# Altium project Copy of MB1248.PrjPCB (part 1 of 3)
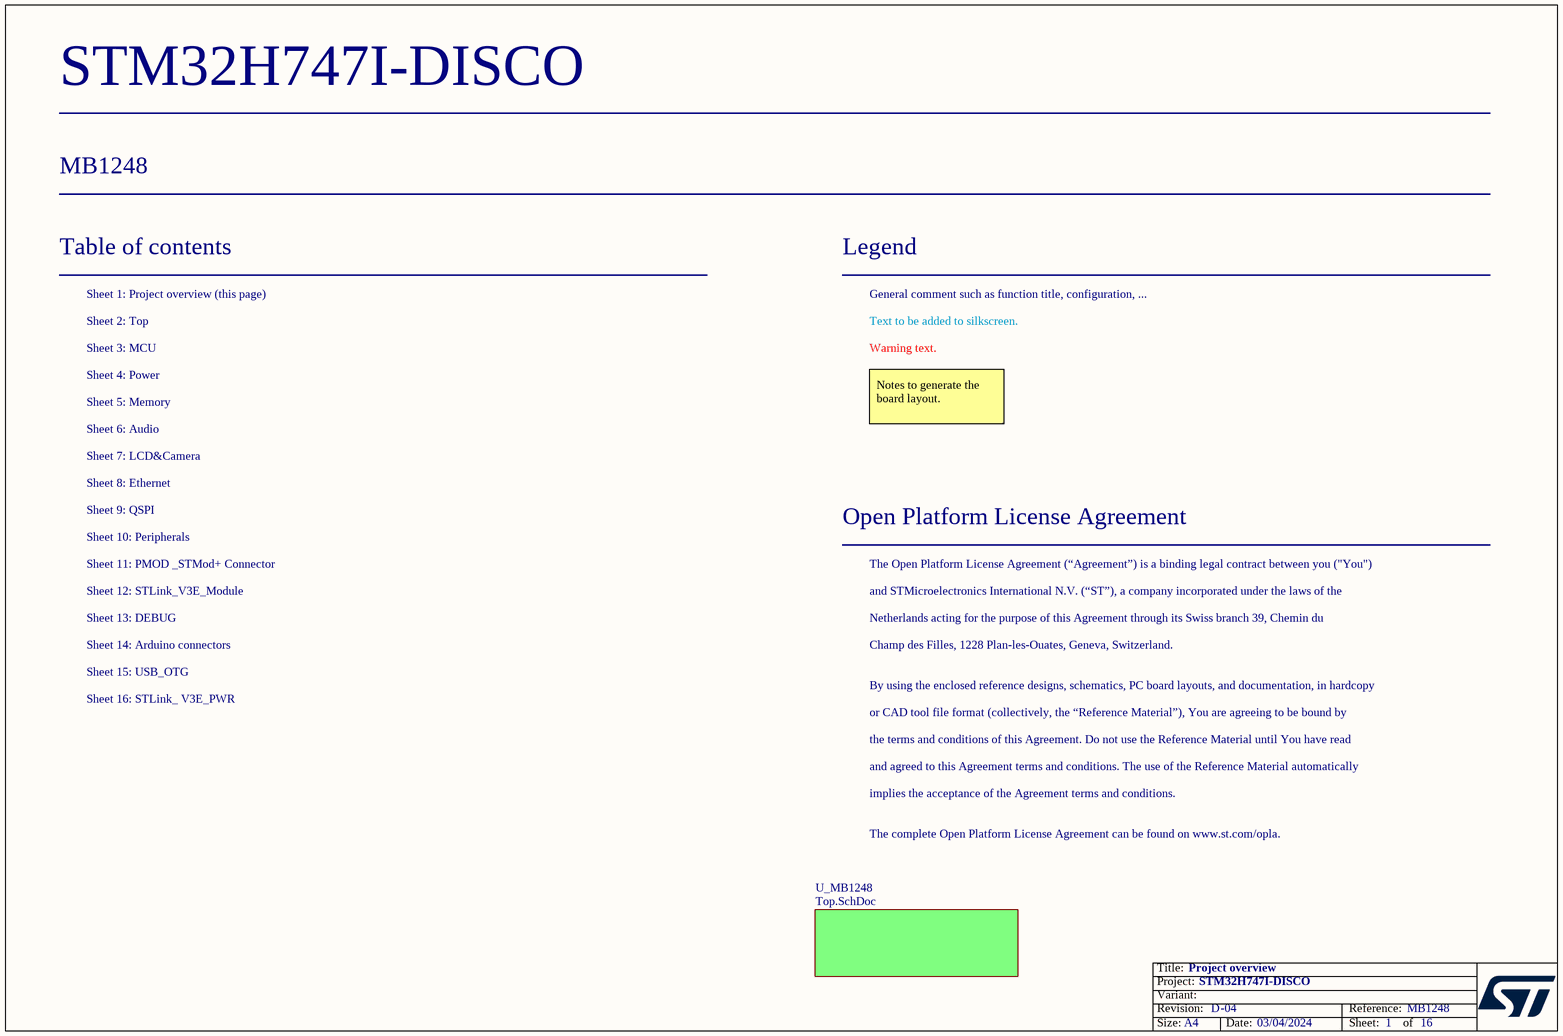
[diagram p0: Project_overview.SchDoc]
Board_Assembly_revision: 04; Board_Document_Date: 03/04/2024; Board_Name: STM32H747I-DISCO; Board_PCB_Revision: D; Board_Reference: MB1248
16 sheets, 533 parts. Net scope: flat (ports and power ports of the same name join across sheets).
Board file: PCB1.PcbDoc
Sheets:
  Project_overview.SchDoc
    U_MB1248 = Top.SchDoc
      U_MCU = MCU.SchDoc
      U_Memory = Memory.SchDoc
      U_QSPI = QSPI.SchDoc
      U_Audio = Audio.SchDoc
      U_Ethernet = Ethernet.SchDoc
      U_Peripherals = Peripherals.SchDoc
      U_Arduino Connectors = Arduino_Connectors.SchDoc
      U_Power = Power.SchDoc
      U_USB_OTG = USB_OTG .SchDoc
      U_LCD&Camera Connectors = LCD&Camera Connectors.SchDoc
      U_DEBUG = DEBUG.SchDoc
      U_STLink_V3E_Module = STLink_V3E_Module.SchDoc
      U_STLink_V3E_PWR = STLink_V3E_PWR.SchDoc
      U_PMOD_STMod+ connector = PMOD_STMod+ connector .SchDoc

## Sheet Project_overview.SchDoc: Project overview
size A4; Date: Not used; ApprovedBy: Not used; CheckedBy: Not used; Author: Not used; CompanyName: STMicroelectronics; DrawnBy: Not used; Engineer: Not used; Organization: Not used; Address1: Not used; Address2: Not used; Address3: Not used; Address4: Not used; DocumentNumber: MB1166; Revision: Not used; SheetNumber: 1; SheetTotal: 16; CurrentTime: Not used; CurrentDate: Not used; Time: Not used; DocumentFullPathAndName: Not used; DocumentName: Not used; ModifiedDate: Not used; ImagePath: Not used; ProjectName: Not used; Application_BuildNumber: Not used

### Sub-sheets
U_MB1248 = Top.SchDoc: no entries

### Notes on the sheet
- Table of contents
- Sheet 1: Project overview (this page)
- Legend
- General comment such as function title, configuration, ...
- Sheet 2: Top
- Sheet 3: MCU
- Sheet 4: Power
- Text to be added to silkscreen.
- Warning text.
- Sheet 5: Memory
- Sheet 6: Audio
- Notes to generate the board layout.
- Sheet 7: LCD&Camera
- Sheet 8: Ethernet
- Sheet 9: QSPI
- Sheet 10: Peripherals
- Sheet 11: PMOD _STMod+ Connector
- Open Platform License Agreement
- The Open Platform License Agreement (“Agreement”) is a binding legal contract between you ("You")
- Sheet 12: STLink_V3E_Module
- Sheet 13: DEBUG
- Sheet 14: Arduino connectors
- and STMicroelectronics International N.V. (“ST”), a company incorporated under the laws of the
- Netherlands acting for the purpose of this Agreement through its Swiss branch 39, Chemin du
- Champ des Filles, 1228 Plan-les-Ouates, Geneva, Switzerland.
- Sheet 15: USB_OTG
- Sheet 16: STLink_ V3E_PWR
- By using the enclosed reference designs, schematics, PC board layouts, and documentation, in hardcopy
- or CAD tool file format (collectively, the “Reference Material”), You are agreeing to be bound by
- the terms and conditions of this Agreement. Do not use the Reference Material until You have read
- and agreed to this Agreement terms and conditions. The use of the Reference Material automatically
- implies the acceptance of the Agreement terms and conditions.
- The complete Open Platform License Agreement can be found on www.st.com/opla.
- Title:
- Project:
- Size:
- Revision:
- Variant:
- A4
- -
- Date:
- Reference:
- Sheet:
- of

## Sheet Top.SchDoc: Top
size A3; Project: STM32H7-DK; Date: Not used; ApprovedBy: Not used; CheckedBy: Not used; Author: Not used; CompanyName: STMicroelectronics; DrawnBy: Not used; Engineer: Not used; Organization: Not used; Address1: Not used; Address2: Not used; Address3: Not used; Address4: Not used; DocumentNumber: Not used; Revision: Not used; SheetNumber: 2; SheetTotal: 16; CurrentTime: Not used; CurrentDate: Not used; Time: Not used; DocumentFullPathAndName: Not used; DocumentName: Not used; ModifiedDate: Not used; ImagePath: Not used; ProjectName: Not used; Application_BuildNumber: Not used
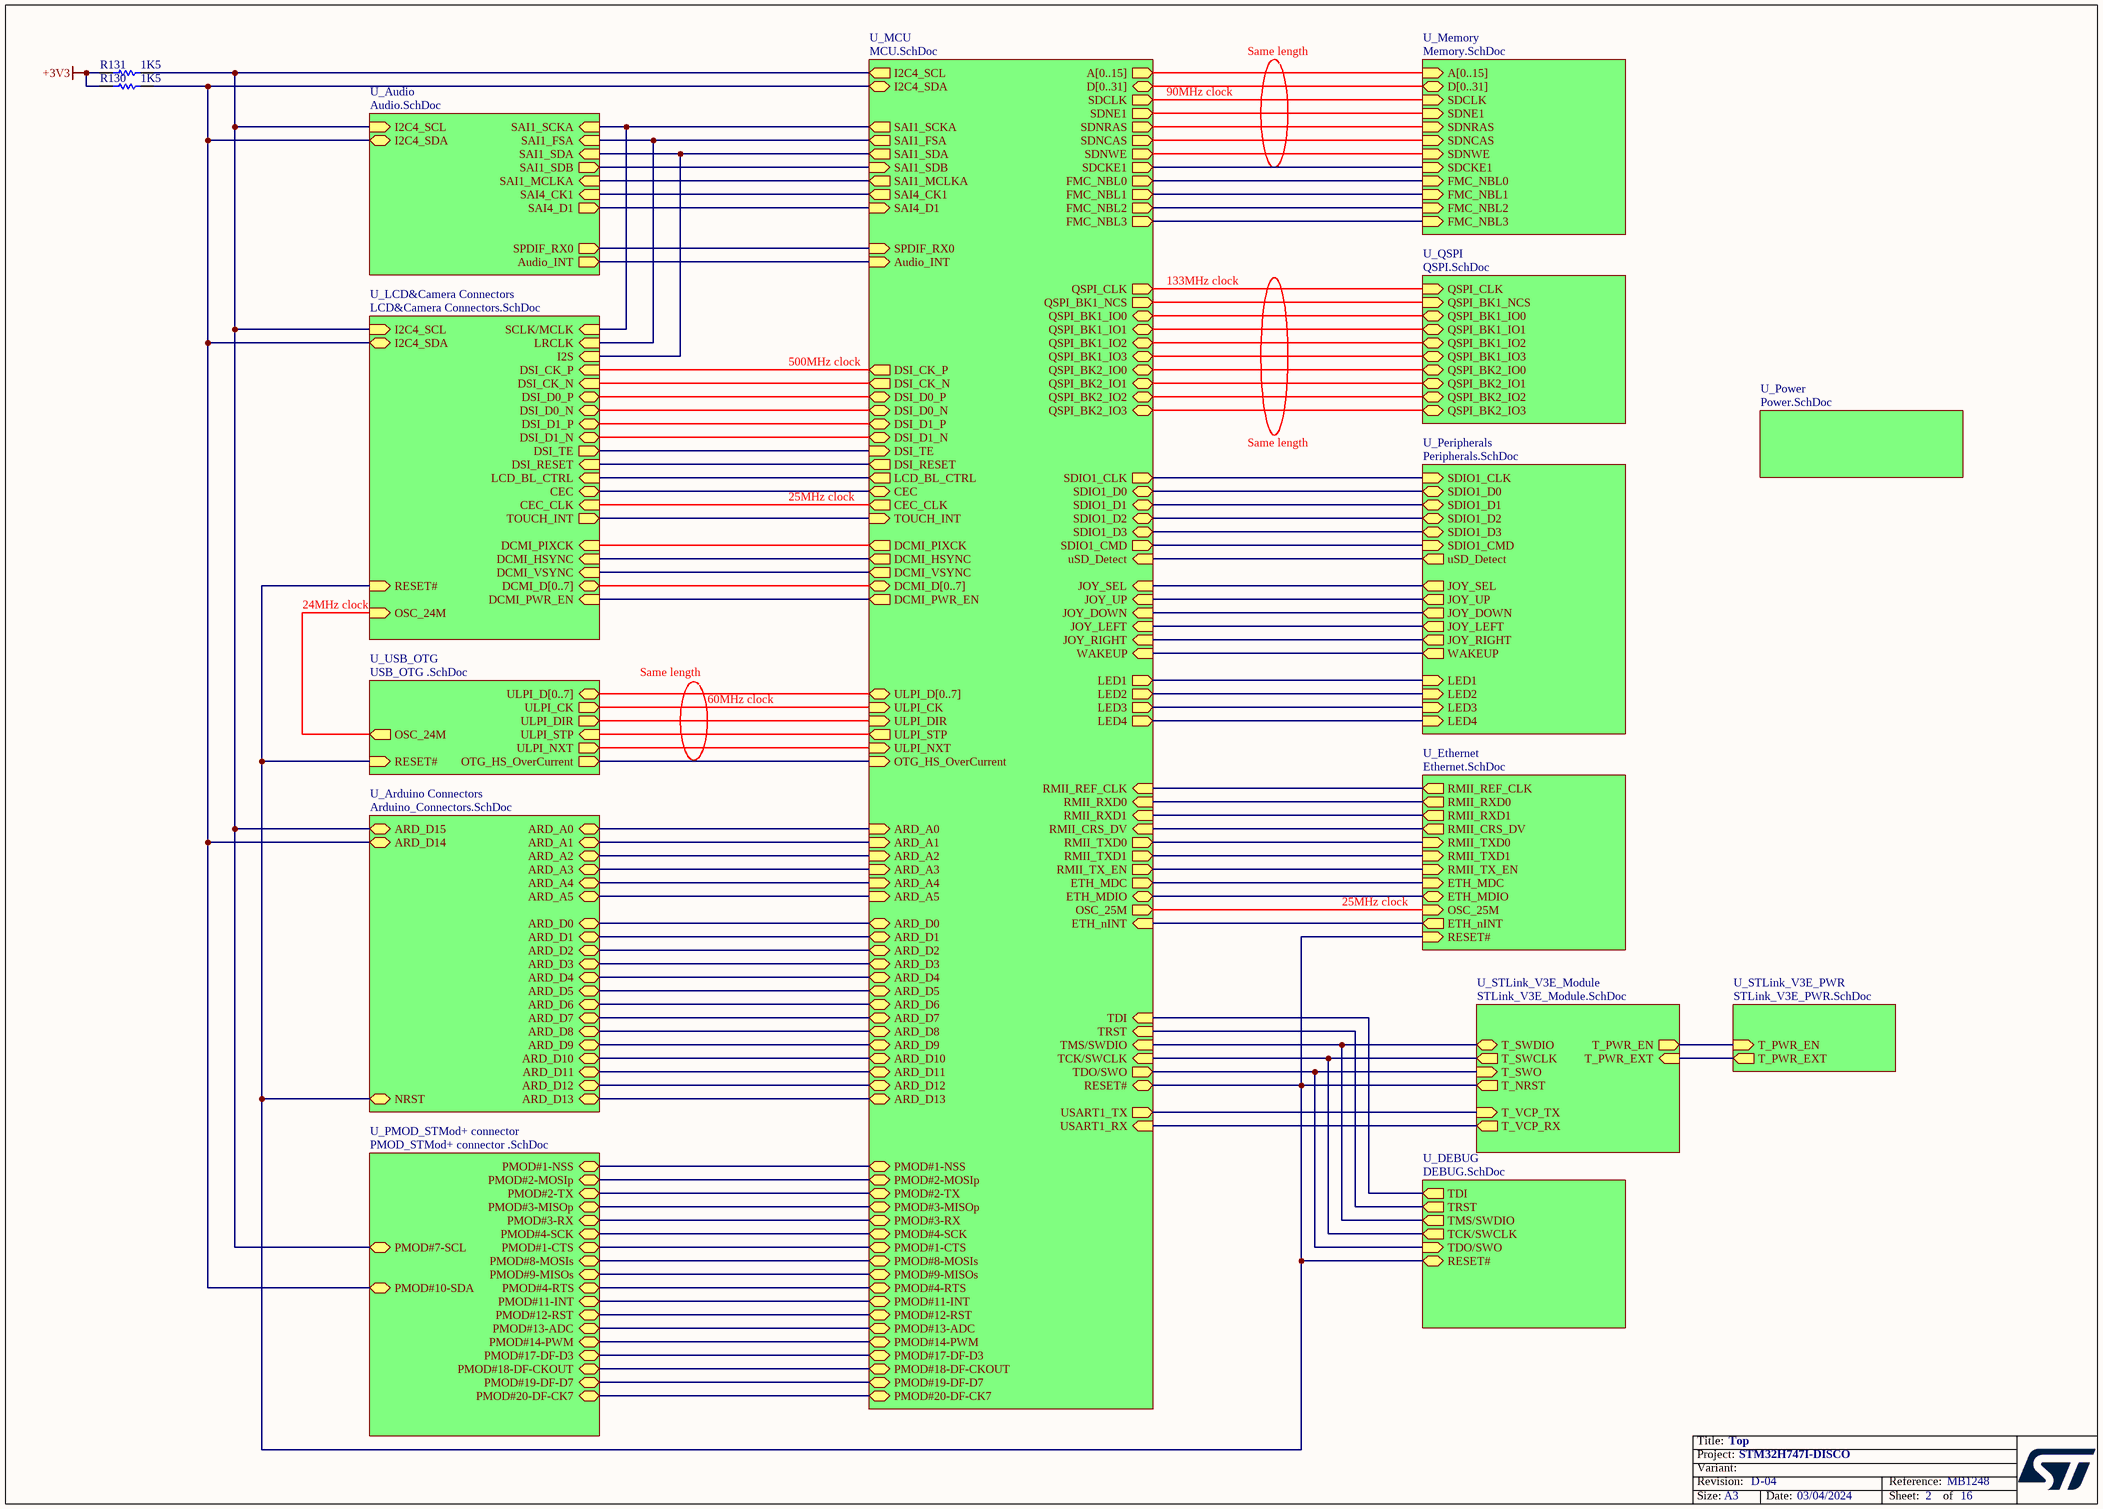
[diagram p1: Top.SchDoc]

### Parts
R130  1K5  [0603R]
R131  1K5  [0603R]

### Sub-sheets
U_Arduino Connectors = Arduino_Connectors.SchDoc: NRST (bidir), ARD_A0 (bidir), ARD_A1 (bidir), ARD_A2 (bidir), ARD_A3 (bidir), ARD_A4 (bidir), ARD_A5 (bidir), ARD_D5 (bidir), ARD_D4 (bidir), ARD_D3 (bidir), ARD_D2 (bidir), ARD_D1 (bidir), ARD_D0 (bidir), ARD_D13 (bidir), ARD_D12 (bidir), ARD_D11 (bidir), ARD_D10 (bidir), ARD_D9 (bidir), ARD_D8 (bidir), ARD_D6 (bidir), ARD_D7 (bidir), ARD_D15 (bidir), ARD_D14 (bidir)
U_Audio = Audio.SchDoc: SAI1_SCKA (in), SAI1_FSA (in), SAI1_SDA (in), SAI1_SDB (out), Audio_INT (out), I2C4_SDA (bidir), I2C4_SCL (in), SAI1_MCLKA (in), SPDIF_RX0 (out), SAI4_CK1 (in), SAI4_D1 (out)
U_DEBUG = DEBUG.SchDoc: TDI (out), RESET# (bidir), TRST (out), TMS/SWDIO (out), TCK/SWCLK (out), TDO/SWO (in)
U_Ethernet = Ethernet.SchDoc: RMII_TXD0 (in), RMII_TX_EN (in), RMII_RXD0 (out), RMII_REF_CLK (out), RMII_CRS_DV (out), ETH_MDC (in), ETH_MDIO (bidir), RMII_TXD1 (in), RMII_RXD1 (out), RESET# (in), OSC_25M (in), ETH_nINT (out)
U_LCD&Camera Connectors = LCD&Camera Connectors.SchDoc: TOUCH_INT (out), DSI_CK_P (in), DSI_CK_N (in), DSI_D0_P (bidir), DSI_D0_N (bidir), DSI_D1_P (bidir), DSI_D1_N (bidir), LCD_BL_CTRL (in), DSI_TE (out), DSI_RESET (in), SCLK/MCLK (in), LRCLK (in), I2S (in), CEC (bidir), CEC_CLK (in), DCMI_D[0..7] (bidir), DCMI_PWR_EN (in), DCMI_VSYNC (in), DCMI_HSYNC (in), DCMI_PIXCK (in), RESET# (in), I2C4_SCL (in), I2C4_SDA (bidir), OSC_24M (in)
U_MCU = MCU.SchDoc: TMS/SWDIO (in), TCK/SWCLK (in), TDI (in), ULPI_STP (out), ETH_MDC (out), RMII_RXD0 (in), RMII_RXD1 (in), SDIO1_D0 (bidir), SDIO1_CLK (out), SDIO1_CMD (out), uSD_Detect (in), FMC_NBL3 (out), FMC_NBL2 (out), FMC_NBL0 (out), FMC_NBL1 (out), SAI1_SDA (out), SAI1_SDB (in), SAI1_SCKA (out), SAI1_FSA (out), SAI1_MCLKA (out), SDNRAS (out), SDCLK (out), RMII_TX_EN (out), RMII_TXD1 (out), SDNCAS (out), SDCKE1 (out), SDNE1 (out), ULPI_NXT (in), SDNWE (out), D[0..31] (bidir), A[0..15] (out), ULPI_D[0..7] (bidir), QSPI_BK1_IO3 (bidir), QSPI_BK1_IO2 (bidir), QSPI_BK1_IO1 (bidir), DSI_TE (in), DSI_CK_P (out), DSI_CK_N (out), DSI_D0_P (bidir), DSI_D0_N (bidir), DSI_D1_P (bidir), DSI_D1_N (bidir), ARD_A1 (in), LED1 (out), LED2 (out), LED3 (out), LED4 (out), RMII_REF_CLK (in), ETH_MDIO (bidir), ULPI_CK (in), RMII_CRS_DV (in), CEC_CLK (out), TDO/SWO (out), TRST (in), QSPI_BK1_NCS (out), RMII_TXD0 (out), QSPI_CLK (out), SDIO1_D1 (bidir), SDIO1_D2 (bidir), SDIO1_D3 (bidir), QSPI_BK2_IO2 (bidir), QSPI_BK2_IO3 (bidir), QSPI_BK2_IO0 (bidir), QSPI_BK2_IO1 (bidir), RESET# (bidir), CEC (bidir), DCMI_PWR_EN (out), DCMI_VSYNC (out), DCMI_HSYNC (out), DCMI_PIXCK (out), ARD_A0 (in), ARD_A2 (in), ARD_A3 (in), ARD_A5 (in), ARD_A4 (in), ARD_D10 (bidir), ARD_D11 (bidir), ARD_D12 (bidir), ARD_D13 (bidir), I2C4_SCL (out), I2C4_SDA (bidir), ARD_D1 (bidir), ARD_D2 (bidir), ARD_D3 (bidir), ARD_D4 (bidir), ARD_D5 (bidir), ARD_D6 (bidir), ARD_D7 (bidir), ARD_D8 (bidir), ARD_D9 (bidir), ARD_D0 (bidir), Audio_INT (in), LCD_BL_CTRL (out), DSI_RESET (out), JOY_SEL (in), JOY_DOWN (in), JOY_LEFT (in), JOY_RIGHT (in), JOY_UP (in), TOUCH_INT (in), OTG_HS_OverCurrent (in), QSPI_BK1_IO0 (bidir), SPDIF_RX0 (in), ULPI_DIR (in), OSC_25M (out), DCMI_D[0..7] (bidir), PMOD#3-MISOp (bidir), PMOD#2-TX (bidir), PMOD#2-MOSIp (bidir), PMOD#3-RX (bidir), PMOD#8-MOSIs (bidir), PMOD#9-MISOs (bidir), PMOD#11-INT (bidir), PMOD#12-RST (bidir), PMOD#13-ADC (bidir), PMOD#14-PWM (bidir), PMOD#17-DF-D3 (bidir), PMOD#19-DF-D7 (bidir), PMOD#20-DF-CK7 (bidir), WAKEUP (in), PMOD#18-DF-CKOUT (bidir), SAI4_CK1 (out), SAI4_D1 (in), PMOD#1-NSS (bidir), PMOD#4-RTS (bidir), USART1_TX (out), PMOD#1-CTS (bidir), PMOD#4-SCK (bidir), USART1_RX (in), ETH_nINT (in)
U_Memory = Memory.SchDoc: FMC_NBL0 (in), FMC_NBL1 (in), D[0..31] (bidir), A[0..15] (in), SDNCAS (in), SDNWE (in), SDNRAS (in), SDNE1 (in), SDCKE1 (in), SDCLK (in), FMC_NBL3 (in), FMC_NBL2 (in)
U_Peripherals = Peripherals.SchDoc: JOY_SEL (out), JOY_DOWN (out), JOY_LEFT (out), JOY_RIGHT (out), JOY_UP (out), LED4 (in), LED3 (in), LED1 (in), LED2 (in), uSD_Detect (out), WAKEUP (out), SDIO1_CLK (in), SDIO1_CMD (in), SDIO1_D0 (bidir), SDIO1_D1 (bidir), SDIO1_D2 (bidir), SDIO1_D3 (bidir)
U_PMOD_STMod+ connector = PMOD_STMod+ connector .SchDoc: PMOD#11-INT (bidir), PMOD#12-RST (bidir), PMOD#1-NSS (bidir), PMOD#3-MISOp (bidir), PMOD#2-TX (bidir), PMOD#2-MOSIp (bidir), PMOD#3-RX (bidir), PMOD#7-SCL (bidir), PMOD#4-SCK (bidir), PMOD#8-MOSIs (bidir), PMOD#9-MISOs (bidir), PMOD#10-SDA (bidir), PMOD#13-ADC (bidir), PMOD#14-PWM (bidir), PMOD#17-DF-D3 (bidir), PMOD#18-DF-CKOUT (bidir), PMOD#19-DF-D7 (bidir), PMOD#20-DF-CK7 (bidir), PMOD#1-CTS (bidir), PMOD#4-RTS (bidir)
U_Power = Power.SchDoc: no entries
U_QSPI = QSPI.SchDoc: QSPI_BK1_IO3 (bidir), QSPI_BK1_IO1 (bidir), QSPI_BK1_NCS (in), QSPI_BK1_IO0 (bidir), QSPI_BK1_IO2 (bidir), QSPI_CLK (in), QSPI_BK2_IO0 (bidir), QSPI_BK2_IO1 (bidir), QSPI_BK2_IO2 (bidir), QSPI_BK2_IO3 (bidir)
U_STLink_V3E_Module = STLink_V3E_Module.SchDoc: T_SWCLK (out), T_SWO (in), T_NRST (out), T_SWDIO (bidir), T_PWR_EXT (in), T_PWR_EN (out), T_VCP_RX (out), T_VCP_TX (in)
U_STLink_V3E_PWR = STLink_V3E_PWR.SchDoc: T_PWR_EXT (out), T_PWR_EN (in)
U_USB_OTG = USB_OTG .SchDoc: ULPI_D[0..7] (bidir), ULPI_CK (out), ULPI_DIR (out), ULPI_NXT (out), ULPI_STP (in), RESET# (in), OTG_HS_OverCurrent (out), OSC_24M (out)

### Nets
+3V3: R130.1 R131.1
NetR130_2: R130.2 ; sheet U_MCU/I2C4_SDA, sheet U_Audio/I2C4_SDA, sheet U_Arduino Connectors/ARD_D14, sheet U_LCD&Camera Connectors/I2C4_SDA, sheet U_PMOD_STMod+ connector/PMOD#10-SDA
NetR131_2: R131.2 ; sheet U_MCU/I2C4_SCL, sheet U_Audio/I2C4_SCL, sheet U_Arduino Connectors/ARD_D15, sheet U_LCD&Camera Connectors/I2C4_SCL, sheet U_PMOD_STMod+ connector/PMOD#7-SCL
(unnamed): sheet U_MCU/TMS/SWDIO, sheet U_DEBUG/TMS/SWDIO, sheet U_STLink_V3E_Module/T_SWDIO
(unnamed): sheet U_MCU/TCK/SWCLK, sheet U_DEBUG/TCK/SWCLK, sheet U_STLink_V3E_Module/T_SWCLK
(unnamed): sheet U_MCU/TDI, sheet U_DEBUG/TDI
(unnamed): sheet U_MCU/ULPI_STP, sheet U_USB_OTG/ULPI_STP
(unnamed): sheet U_MCU/ETH_MDC, sheet U_Ethernet/ETH_MDC
(unnamed): sheet U_MCU/RMII_RXD0, sheet U_Ethernet/RMII_RXD0
(unnamed): sheet U_MCU/RMII_RXD1, sheet U_Ethernet/RMII_RXD1
(unnamed): sheet U_MCU/SDIO1_D0, sheet U_Peripherals/SDIO1_D0
(unnamed): sheet U_MCU/SDIO1_CLK, sheet U_Peripherals/SDIO1_CLK
(unnamed): sheet U_MCU/SDIO1_CMD, sheet U_Peripherals/SDIO1_CMD
(unnamed): sheet U_MCU/uSD_Detect, sheet U_Peripherals/uSD_Detect
(unnamed): sheet U_MCU/FMC_NBL3, sheet U_Memory/FMC_NBL3
(unnamed): sheet U_MCU/FMC_NBL2, sheet U_Memory/FMC_NBL2
(unnamed): sheet U_MCU/FMC_NBL0, sheet U_Memory/FMC_NBL0
(unnamed): sheet U_MCU/FMC_NBL1, sheet U_Memory/FMC_NBL1
(unnamed): sheet U_MCU/SAI1_SDA, sheet U_Audio/SAI1_SDA, sheet U_LCD&Camera Connectors/I2S
(unnamed): sheet U_MCU/SAI1_SDB, sheet U_Audio/SAI1_SDB
(unnamed): sheet U_MCU/SAI1_SCKA, sheet U_Audio/SAI1_SCKA, sheet U_LCD&Camera Connectors/SCLK/MCLK
(unnamed): sheet U_MCU/SAI1_FSA, sheet U_Audio/SAI1_FSA, sheet U_LCD&Camera Connectors/LRCLK
(unnamed): sheet U_MCU/SAI1_MCLKA, sheet U_Audio/SAI1_MCLKA
(unnamed): sheet U_MCU/SDNRAS, sheet U_Memory/SDNRAS
(unnamed): sheet U_MCU/SDCLK, sheet U_Memory/SDCLK
(unnamed): sheet U_MCU/RMII_TX_EN, sheet U_Ethernet/RMII_TX_EN
(unnamed): sheet U_MCU/RMII_TXD1, sheet U_Ethernet/RMII_TXD1
(unnamed): sheet U_MCU/SDNCAS, sheet U_Memory/SDNCAS
(unnamed): sheet U_MCU/SDCKE1, sheet U_Memory/SDCKE1
(unnamed): sheet U_MCU/SDNE1, sheet U_Memory/SDNE1
(unnamed): sheet U_MCU/ULPI_NXT, sheet U_USB_OTG/ULPI_NXT
(unnamed): sheet U_MCU/SDNWE, sheet U_Memory/SDNWE
(unnamed): sheet U_MCU/QSPI_BK1_IO3, sheet U_QSPI/QSPI_BK1_IO3
(unnamed): sheet U_MCU/QSPI_BK1_IO2, sheet U_QSPI/QSPI_BK1_IO2
(unnamed): sheet U_MCU/QSPI_BK1_IO1, sheet U_QSPI/QSPI_BK1_IO1
(unnamed): sheet U_MCU/DSI_TE, sheet U_LCD&Camera Connectors/DSI_TE
(unnamed): sheet U_MCU/DSI_CK_P, sheet U_LCD&Camera Connectors/DSI_CK_P
(unnamed): sheet U_MCU/DSI_CK_N, sheet U_LCD&Camera Connectors/DSI_CK_N
(unnamed): sheet U_MCU/DSI_D0_P, sheet U_LCD&Camera Connectors/DSI_D0_P
(unnamed): sheet U_MCU/DSI_D0_N, sheet U_LCD&Camera Connectors/DSI_D0_N
(unnamed): sheet U_MCU/DSI_D1_P, sheet U_LCD&Camera Connectors/DSI_D1_P
(unnamed): sheet U_MCU/DSI_D1_N, sheet U_LCD&Camera Connectors/DSI_D1_N
(unnamed): sheet U_MCU/ARD_A1, sheet U_Arduino Connectors/ARD_A1
(unnamed): sheet U_MCU/LED1, sheet U_Peripherals/LED1
(unnamed): sheet U_MCU/LED2, sheet U_Peripherals/LED2
(unnamed): sheet U_MCU/LED3, sheet U_Peripherals/LED3
(unnamed): sheet U_MCU/LED4, sheet U_Peripherals/LED4
(unnamed): sheet U_MCU/RMII_REF_CLK, sheet U_Ethernet/RMII_REF_CLK
(unnamed): sheet U_MCU/ETH_MDIO, sheet U_Ethernet/ETH_MDIO
(unnamed): sheet U_MCU/ULPI_CK, sheet U_USB_OTG/ULPI_CK
(unnamed): sheet U_MCU/RMII_CRS_DV, sheet U_Ethernet/RMII_CRS_DV
(unnamed): sheet U_MCU/CEC_CLK, sheet U_LCD&Camera Connectors/CEC_CLK
(unnamed): sheet U_MCU/TDO/SWO, sheet U_DEBUG/TDO/SWO, sheet U_STLink_V3E_Module/T_SWO
(unnamed): sheet U_MCU/TRST, sheet U_DEBUG/TRST
(unnamed): sheet U_MCU/QSPI_BK1_NCS, sheet U_QSPI/QSPI_BK1_NCS
(unnamed): sheet U_MCU/RMII_TXD0, sheet U_Ethernet/RMII_TXD0
(unnamed): sheet U_MCU/QSPI_CLK, sheet U_QSPI/QSPI_CLK
(unnamed): sheet U_MCU/SDIO1_D1, sheet U_Peripherals/SDIO1_D1
(unnamed): sheet U_MCU/SDIO1_D2, sheet U_Peripherals/SDIO1_D2
(unnamed): sheet U_MCU/SDIO1_D3, sheet U_Peripherals/SDIO1_D3
(unnamed): sheet U_MCU/QSPI_BK2_IO2, sheet U_QSPI/QSPI_BK2_IO2
(unnamed): sheet U_MCU/QSPI_BK2_IO3, sheet U_QSPI/QSPI_BK2_IO3
(unnamed): sheet U_MCU/QSPI_BK2_IO0, sheet U_QSPI/QSPI_BK2_IO0
(unnamed): sheet U_MCU/QSPI_BK2_IO1, sheet U_QSPI/QSPI_BK2_IO1
(unnamed): sheet U_MCU/RESET#, sheet U_Ethernet/RESET#, sheet U_Arduino Connectors/NRST, sheet U_USB_OTG/RESET#, sheet U_LCD&Camera Connectors/RESET#, sheet U_DEBUG/RESET#, sheet U_STLink_V3E_Module/T_NRST
(unnamed): sheet U_MCU/CEC, sheet U_LCD&Camera Connectors/CEC
(unnamed): sheet U_MCU/DCMI_PWR_EN, sheet U_LCD&Camera Connectors/DCMI_PWR_EN
(unnamed): sheet U_MCU/DCMI_VSYNC, sheet U_LCD&Camera Connectors/DCMI_VSYNC
(unnamed): sheet U_MCU/DCMI_HSYNC, sheet U_LCD&Camera Connectors/DCMI_HSYNC
(unnamed): sheet U_MCU/DCMI_PIXCK, sheet U_LCD&Camera Connectors/DCMI_PIXCK
(unnamed): sheet U_MCU/ARD_A0, sheet U_Arduino Connectors/ARD_A0
(unnamed): sheet U_MCU/ARD_A2, sheet U_Arduino Connectors/ARD_A2
(unnamed): sheet U_MCU/ARD_A3, sheet U_Arduino Connectors/ARD_A3
(unnamed): sheet U_MCU/ARD_A5, sheet U_Arduino Connectors/ARD_A5
(unnamed): sheet U_MCU/ARD_A4, sheet U_Arduino Connectors/ARD_A4
(unnamed): sheet U_MCU/ARD_D10, sheet U_Arduino Connectors/ARD_D10
(unnamed): sheet U_MCU/ARD_D11, sheet U_Arduino Connectors/ARD_D11
(unnamed): sheet U_MCU/ARD_D12, sheet U_Arduino Connectors/ARD_D12
(unnamed): sheet U_MCU/ARD_D13, sheet U_Arduino Connectors/ARD_D13
(unnamed): sheet U_MCU/ARD_D1, sheet U_Arduino Connectors/ARD_D1
(unnamed): sheet U_MCU/ARD_D2, sheet U_Arduino Connectors/ARD_D2
(unnamed): sheet U_MCU/ARD_D3, sheet U_Arduino Connectors/ARD_D3
(unnamed): sheet U_MCU/ARD_D4, sheet U_Arduino Connectors/ARD_D4
(unnamed): sheet U_MCU/ARD_D5, sheet U_Arduino Connectors/ARD_D5
(unnamed): sheet U_MCU/ARD_D6, sheet U_Arduino Connectors/ARD_D6
(unnamed): sheet U_MCU/ARD_D7, sheet U_Arduino Connectors/ARD_D7
(unnamed): sheet U_MCU/ARD_D8, sheet U_Arduino Connectors/ARD_D8
(unnamed): sheet U_MCU/ARD_D9, sheet U_Arduino Connectors/ARD_D9
(unnamed): sheet U_MCU/ARD_D0, sheet U_Arduino Connectors/ARD_D0
(unnamed): sheet U_MCU/Audio_INT, sheet U_Audio/Audio_INT
(unnamed): sheet U_MCU/LCD_BL_CTRL, sheet U_LCD&Camera Connectors/LCD_BL_CTRL
(unnamed): sheet U_MCU/DSI_RESET, sheet U_LCD&Camera Connectors/DSI_RESET
(unnamed): sheet U_MCU/JOY_SEL, sheet U_Peripherals/JOY_SEL
(unnamed): sheet U_MCU/JOY_DOWN, sheet U_Peripherals/JOY_DOWN
(unnamed): sheet U_MCU/JOY_LEFT, sheet U_Peripherals/JOY_LEFT
(unnamed): sheet U_MCU/JOY_RIGHT, sheet U_Peripherals/JOY_RIGHT
(unnamed): sheet U_MCU/JOY_UP, sheet U_Peripherals/JOY_UP
(unnamed): sheet U_MCU/TOUCH_INT, sheet U_LCD&Camera Connectors/TOUCH_INT
(unnamed): sheet U_MCU/OTG_HS_OverCurrent, sheet U_USB_OTG/OTG_HS_OverCurrent
(unnamed): sheet U_MCU/QSPI_BK1_IO0, sheet U_QSPI/QSPI_BK1_IO0
(unnamed): sheet U_MCU/SPDIF_RX0, sheet U_Audio/SPDIF_RX0
(unnamed): sheet U_MCU/ULPI_DIR, sheet U_USB_OTG/ULPI_DIR
(unnamed): sheet U_MCU/OSC_25M, sheet U_Ethernet/OSC_25M
(unnamed): sheet U_MCU/PMOD#3-MISOp, sheet U_PMOD_STMod+ connector/PMOD#3-MISOp
(unnamed): sheet U_MCU/PMOD#2-TX, sheet U_PMOD_STMod+ connector/PMOD#2-TX
(unnamed): sheet U_MCU/PMOD#2-MOSIp, sheet U_PMOD_STMod+ connector/PMOD#2-MOSIp
(unnamed): sheet U_MCU/PMOD#3-RX, sheet U_PMOD_STMod+ connector/PMOD#3-RX
(unnamed): sheet U_MCU/PMOD#8-MOSIs, sheet U_PMOD_STMod+ connector/PMOD#8-MOSIs
(unnamed): sheet U_MCU/PMOD#9-MISOs, sheet U_PMOD_STMod+ connector/PMOD#9-MISOs
(unnamed): sheet U_MCU/PMOD#11-INT, sheet U_PMOD_STMod+ connector/PMOD#11-INT
(unnamed): sheet U_MCU/PMOD#12-RST, sheet U_PMOD_STMod+ connector/PMOD#12-RST
(unnamed): sheet U_MCU/PMOD#13-ADC, sheet U_PMOD_STMod+ connector/PMOD#13-ADC
(unnamed): sheet U_MCU/PMOD#14-PWM, sheet U_PMOD_STMod+ connector/PMOD#14-PWM
(unnamed): sheet U_MCU/PMOD#17-DF-D3, sheet U_PMOD_STMod+ connector/PMOD#17-DF-D3
(unnamed): sheet U_MCU/PMOD#19-DF-D7, sheet U_PMOD_STMod+ connector/PMOD#19-DF-D7
(unnamed): sheet U_MCU/PMOD#20-DF-CK7, sheet U_PMOD_STMod+ connector/PMOD#20-DF-CK7
(unnamed): sheet U_MCU/WAKEUP, sheet U_Peripherals/WAKEUP
(unnamed): sheet U_MCU/PMOD#18-DF-CKOUT, sheet U_PMOD_STMod+ connector/PMOD#18-DF-CKOUT
(unnamed): sheet U_MCU/SAI4_CK1, sheet U_Audio/SAI4_CK1
(unnamed): sheet U_MCU/SAI4_D1, sheet U_Audio/SAI4_D1
(unnamed): sheet U_MCU/PMOD#1-NSS, sheet U_PMOD_STMod+ connector/PMOD#1-NSS
(unnamed): sheet U_MCU/PMOD#4-RTS, sheet U_PMOD_STMod+ connector/PMOD#4-RTS
(unnamed): sheet U_MCU/USART1_TX, sheet U_STLink_V3E_Module/T_VCP_TX
(unnamed): sheet U_MCU/PMOD#1-CTS, sheet U_PMOD_STMod+ connector/PMOD#1-CTS
(unnamed): sheet U_MCU/PMOD#4-SCK, sheet U_PMOD_STMod+ connector/PMOD#4-SCK
(unnamed): sheet U_MCU/USART1_RX, sheet U_STLink_V3E_Module/T_VCP_RX
(unnamed): sheet U_MCU/ETH_nINT, sheet U_Ethernet/ETH_nINT
(unnamed): sheet U_USB_OTG/OSC_24M, sheet U_LCD&Camera Connectors/OSC_24M
(unnamed): sheet U_STLink_V3E_Module/T_PWR_EXT, sheet U_STLink_V3E_PWR/T_PWR_EXT
(unnamed): sheet U_STLink_V3E_Module/T_PWR_EN, sheet U_STLink_V3E_PWR/T_PWR_EN

### Buses and harness runs
bus sheet U_LCD&Camera Connectors/DCMI_D[0..7] = sheet U_MCU/DCMI_D[0..7]
bus sheet U_MCU/A[0..15] = sheet U_Memory/A[0..15]
bus sheet U_MCU/D[0..31] = sheet U_Memory/D[0..31]
bus sheet U_MCU/ULPI_D[0..7] = sheet U_USB_OTG/ULPI_D[0..7]

### Notes on the sheet
- 90MHz clock
- Same length
- 133MHz clock
- 500MHz clock
- 25MHz clock
- 24MHz clock
- 60MHz clock
- Title:
- Project:
- Size:
- Revision:
- Variant:
- A3
- -
- Date:
- Reference:
- Sheet:
- of

### Library data of the parts
R130 R131 = Res1: Resistor; Value: 1K; Published: 8-Jun-2000; Revision: July-2002: Re-released for DXP Platform.; Publisher: Altium Limited

## Sheet MCU.SchDoc: MCU
size A3; Project: STM32H7-DK; Date: Not used; ApprovedBy: Not used; CheckedBy: Not used; Author: Not used; CompanyName: STMicroelectronics; DrawnBy: Not used; Engineer: Not used; Organization: Not used; Address1: Not used; Address2: Not used; Address3: Not used; Address4: Not used; DocumentNumber: Not used; Revision: Not used; SheetNumber: 3; SheetTotal: 16; CurrentTime: Not used; CurrentDate: Not used; Time: Not used; DocumentFullPathAndName: Not used; DocumentName: Not used; ModifiedDate: Not used; ImagePath: Not used; ProjectName: Not used; Application_BuildNumber: Not used
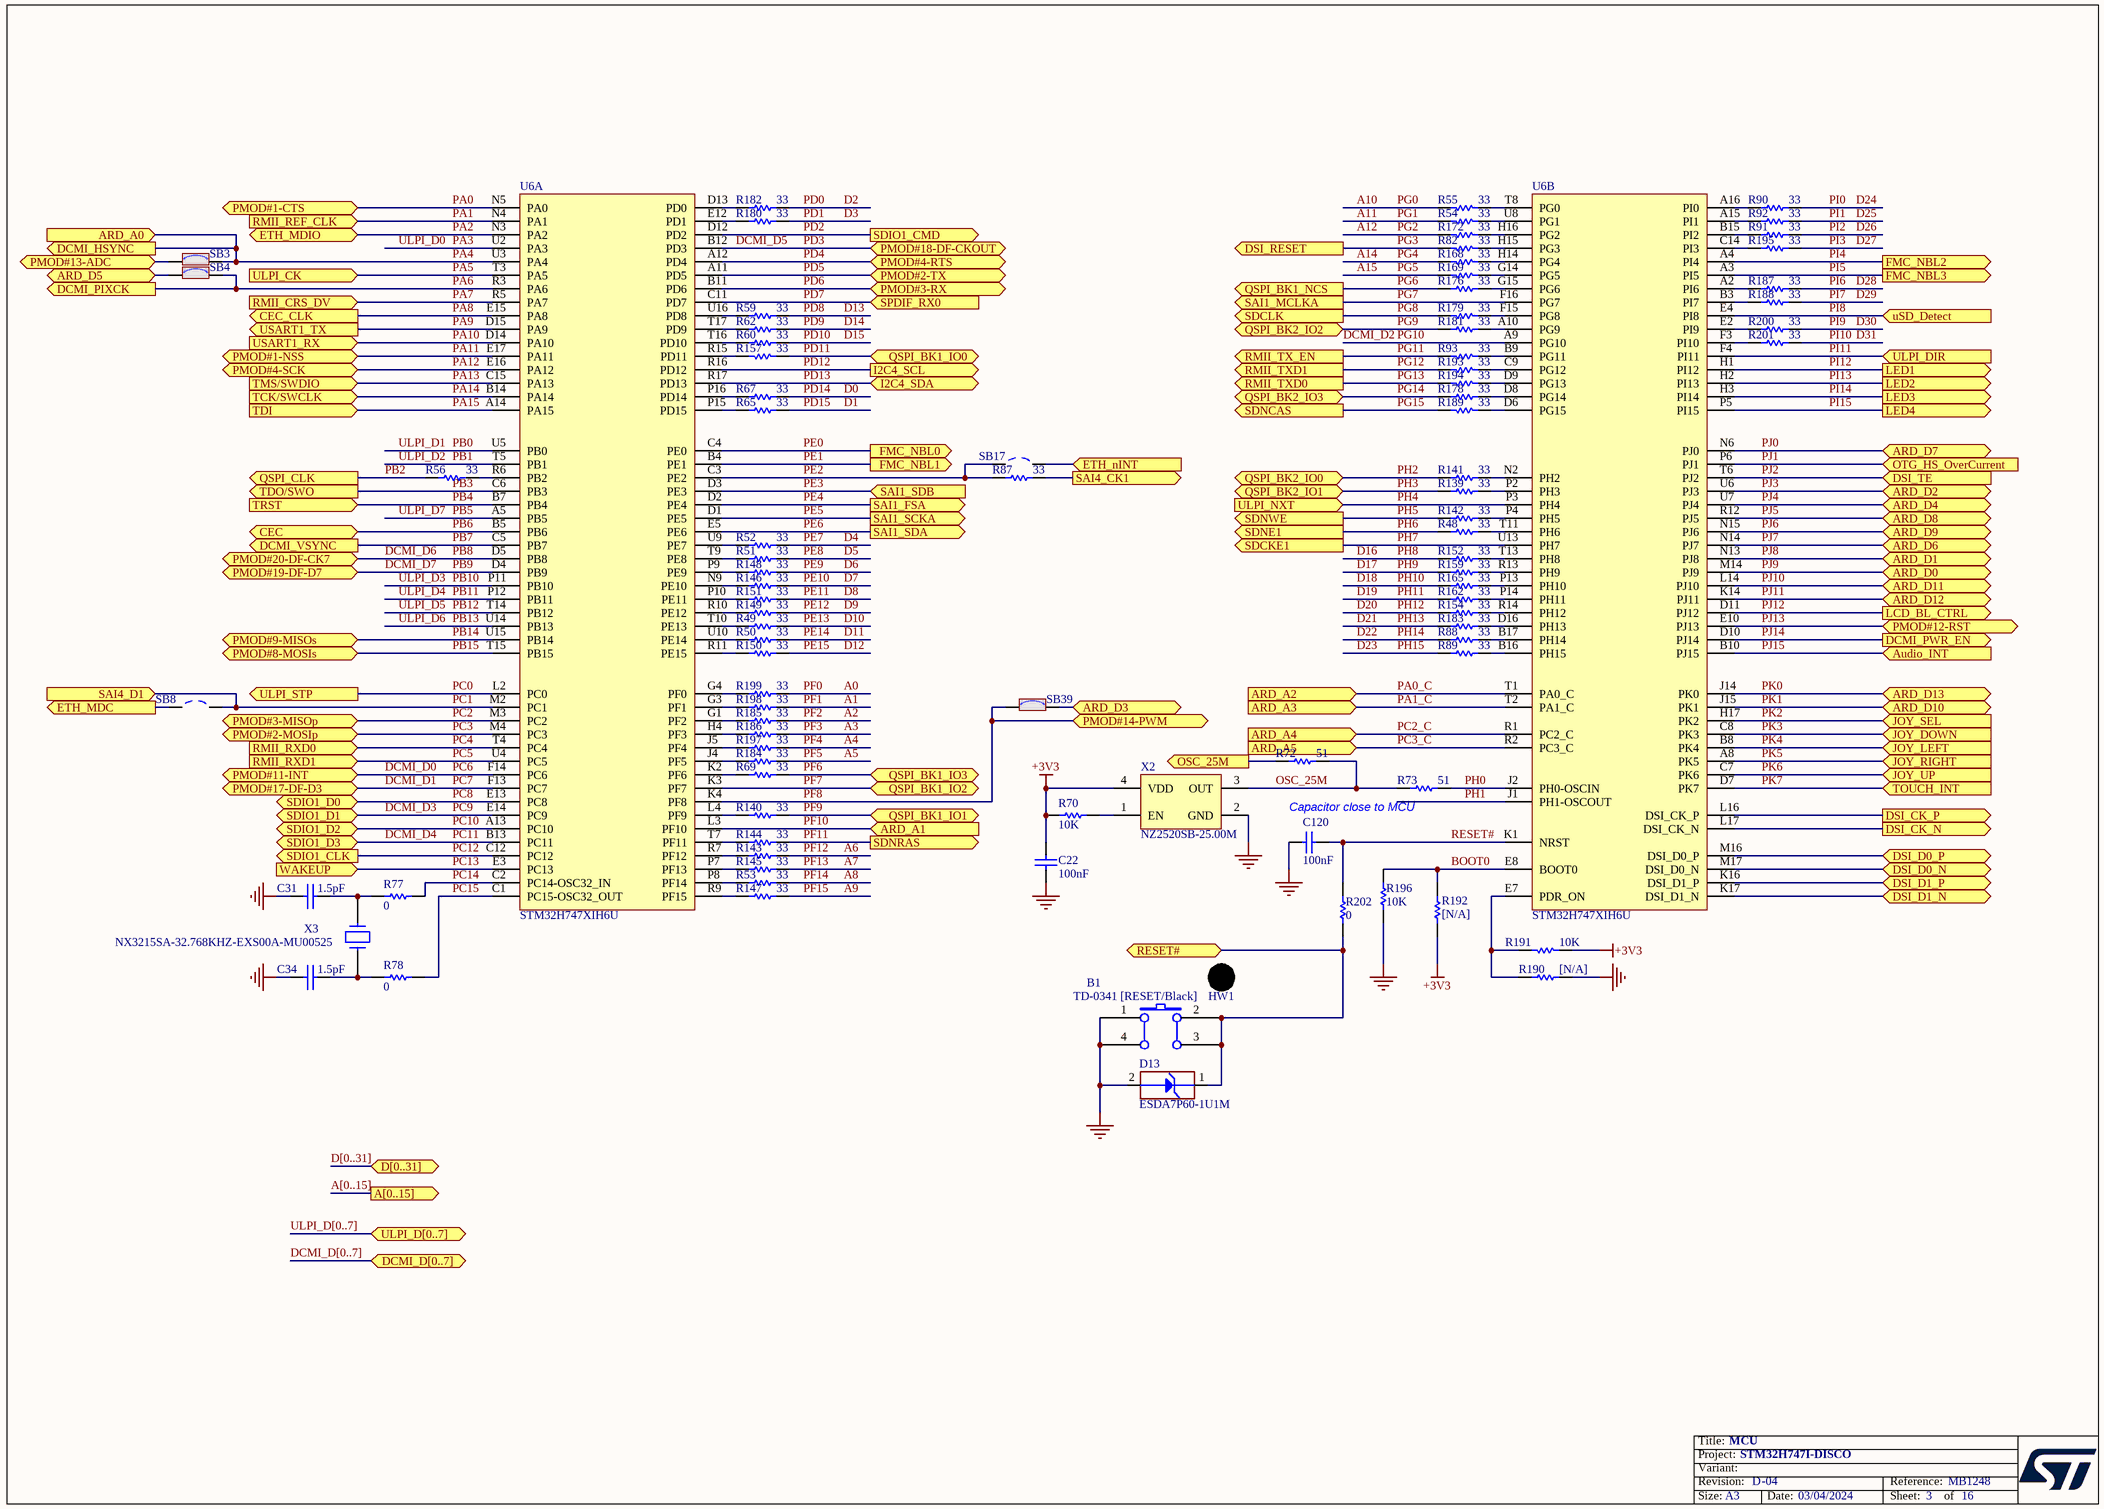
[diagram p2: MCU.SchDoc]

### Parts
B1  TD-0341 [RESET/Black]  [PB10]
C22  100nF  [0603C]
C31  1.5pF  [0603C]
C34  1.5pF  [0603C]
C120  100nF  [0603C]
D13  ESDA7P60-1U1M  [DO_2SM_1R6X1_21]
HW1  SW-CAP-Black  (value not drawn)  (mechanical)
R48  33  [0402R]
R49  33  [0402R]
R50  33  [0402R]
R51  33  [0402R]
R52  33  [0402R]
R53  33  [0402R]
R54  33  [0402R]
R55  33  [0402R]
R56  33  [0402R]
R59  33  [0402R]
R60  33  [0402R]
R62  33  [0402R]
R65  33  [0402R]
R67  33  [0402R]
R69  33  [0402R]
R70  10K  [0603R]
R72  51  [0603R]
R73  51  [0603R]
R77  0  [0402R]
R78  0  [0402R]
R82  33  [0402R]
R87  33  [0402R]
R88  33  [0402R]
R89  33  [0402R]
R90  33  [0402R]
R91  33  [0402R]
R92  33  [0402R]
R93  33  [0603R]
R139  33  [0402R]
R140  33  [0402R]
R141  33  [0402R]
R142  33  [0402R]
R143  33  [0402R]
R144  33  [0402R]
R145  33  [0402R]
R146  33  [0402R]
R147  33  [0402R]
R148  33  [0402R]
R149  33  [0402R]
R150  33  [0402R]
R151  33  [0402R]
R152  33  [0402R]
R154  33  [0402R]
R157  33  [0402R]
R159  33  [0402R]
R162  33  [0402R]
R165  33  [0402R]
R168  33  [0402R]
R169  33  [0402R]
R172  33  [0402R]
R176  33  [0402R]
R178  33  [0402R]
R179  33  [0402R]
R180  33  [0402R]
R181  33  [0402R]
R182  33  [0402R]
R183  33  [0402R]
R184  33  [0402R]
R185  33  [0402R]
R186  33  [0402R]
R187  33  [0402R]
R188  33  [0402R]
R189  33  [0402R]
R190  [N/A]  [0603R]
R191  10K  [0603R]
R192  [N/A]  [0603R]
R193  33  [0603R]
R194  33  [0603R]
R195  33  [0402R]
R196  10K  [0603R]
R197  33  [0402R]
R198  33  [0402R]
R199  33  [0402R]
R200  33  [0402R]
R201  33  [0402R]
R202  0  [0603R]
SB3  Solder Bridge ON  [SB_0603]  (value not drawn)
SB4  Solder Bridge ON  [SB_0603]  (value not drawn)
SB8  Solder Bridge OFF  [SB_0603]  (value not drawn)
SB17  Solder Bridge OFF  [SB_0603]  (value not drawn)
SB39  Solder Bridge ON  [SB_0603]  (value not drawn)
U6  STM32H747XIH6U  [BGA265_0R8_14X14]  (parts A,B of 3)
X2  NZ2520SB-25.00M  [OSC_4SM_2R5X2]
X3  NX3215SA-32.768KHZ-EXS00A-MU00525  [XTAL_2SM_3R2X1R5]

### Ports
A[0..15] (out), ARD_A0 (in), ARD_A1 (in), ARD_A2 (in), ARD_A3 (in), ARD_A4 (in), ARD_A5 (in), ARD_D0 (bidir), ARD_D1 (bidir), ARD_D2 (bidir), ARD_D3 (bidir), ARD_D4 (bidir), ARD_D5 (bidir), ARD_D6 (bidir), ARD_D7 (bidir), ARD_D8 (bidir), ARD_D9 (bidir), ARD_D10 (bidir), ARD_D11 (bidir), ARD_D12 (bidir), ARD_D13 (bidir), Audio_INT (in), CEC (bidir), CEC_CLK (out), D[0..31] (bidir), DCMI_D[0..7] (bidir), DCMI_HSYNC (out), DCMI_PIXCK (out), DCMI_PWR_EN (out), DCMI_VSYNC (out), DSI_CK_N (out), DSI_CK_P (out), DSI_D0_N (bidir), DSI_D0_P (bidir), DSI_D1_N (bidir), DSI_D1_P (bidir), DSI_RESET (out), DSI_TE (in), ETH_MDC (out), ETH_MDIO (bidir), ETH_nINT (in), FMC_NBL0 (out), FMC_NBL1 (out), FMC_NBL2 (out), FMC_NBL3 (out), I2C4_SCL (out), I2C4_SDA (bidir), JOY_DOWN (in), JOY_LEFT (in), JOY_RIGHT (in), JOY_SEL (in), JOY_UP (in), LCD_BL_CTRL (out), LED1 (out), LED2 (out), LED3 (out), LED4 (out), OSC_25M (out), OTG_HS_OverCurrent (in), PMOD#1-CTS (bidir), PMOD#1-NSS (bidir), PMOD#2-MOSIp (bidir), PMOD#2-TX (bidir), PMOD#3-MISOp (bidir), PMOD#3-RX (bidir), PMOD#4-RTS (bidir), PMOD#4-SCK (bidir), PMOD#8-MOSIs (bidir), PMOD#9-MISOs (bidir), PMOD#11-INT (bidir), PMOD#12-RST (bidir), PMOD#13-ADC (bidir), PMOD#14-PWM (bidir), PMOD#17-DF-D3 (bidir), PMOD#18-DF-CKOUT (bidir), PMOD#19-DF-D7 (bidir), PMOD#20-DF-CK7 (bidir), QSPI_BK1_IO0 (bidir), QSPI_BK1_IO1 (bidir), QSPI_BK1_IO2 (bidir), QSPI_BK1_IO3 (bidir), QSPI_BK1_NCS (out), QSPI_BK2_IO0 (bidir), QSPI_BK2_IO1 (bidir), QSPI_BK2_IO2 (bidir), QSPI_BK2_IO3 (bidir), QSPI_CLK (out), RESET# (bidir), RMII_CRS_DV (in), RMII_REF_CLK (in), RMII_RXD0 (in), RMII_RXD1 (in), RMII_TX_EN (out), RMII_TXD0 (out), RMII_TXD1 (out), SAI1_FSA (out), SAI1_MCLKA (out), SAI1_SCKA (out), SAI1_SDA (out), SAI1_SDB (in), SAI4_CK1 (out), SAI4_D1 (in), SDCKE1 (out), SDCLK (out), SDIO1_CLK (out), SDIO1_CMD (out), SDIO1_D0 (bidir), SDIO1_D1 (bidir), SDIO1_D2 (bidir), SDIO1_D3 (bidir), SDNCAS (out), SDNE1 (out), SDNRAS (out), SDNWE (out), SPDIF_RX0 (in), TCK/SWCLK (in), TDI (in), TDO/SWO (out), TMS/SWDIO (in), TOUCH_INT (in), TRST (in), ULPI_CK (in), ULPI_D[0..7] (bidir), ULPI_DIR (in), ULPI_NXT (in), ULPI_STP (out), USART1_RX (in), USART1_TX (out), uSD_Detect (in), WAKEUP (in)

### Nets
+3V3: C22.2 R70.1 R191.1 R192.1 X2.4(VDD)
GND: B1.1(A0) B1.4(A1) C22.1 C31.2 C34.2 C120.1 D13.2(GND) R190.2 R196.2 X2.2(GND)
A0: R199.1  [also labelled PF0]
A1: R198.1  [also labelled PF1]
A2: R185.1  [also labelled PF2]
A3: R186.1  [also labelled PF3]
A4: R197.1  [also labelled PF4]
A5: R184.1  [also labelled PF5]
A6: R143.1  [also labelled PF12]
A7: R145.1  [also labelled PF13]
A8: R53.1  [also labelled PF14]
A9: R147.1  [also labelled PF15]
A10: R55.1  [also labelled PG0]
A11: R54.1  [also labelled PG1]
A12: R172.1  [also labelled PG2]
A14: R168.1  [also labelled PG4]
A15: R169.1  [also labelled PG5]
BOOT0: R192.2 R196.1 U6.E8(BOOT0)
D0: R67.1  [also labelled PD14]
D1: R65.1  [also labelled PD15]
D2: R182.1  [also labelled PD0]
D3: R180.1  [also labelled PD1]
D4: R52.1  [also labelled PE7]
D5: R51.1  [also labelled PE8]
D6: R148.1  [also labelled PE9]
D7: R146.1  [also labelled PE10]
D8: R151.1  [also labelled PE11]
D9: R149.1  [also labelled PE12]
D10: R49.1  [also labelled PE13]
D11: R50.1  [also labelled PE14]
D12: R150.1  [also labelled PE15]
D13: R59.1  [also labelled PD8]
D14: R62.1  [also labelled PD9]
D15: R60.1  [also labelled PD10]
D16: R152.2  [also labelled PH8]
D17: R159.2  [also labelled PH9]
D18: R165.2  [also labelled PH10]
D19: R162.2  [also labelled PH11]
D20: R154.2  [also labelled PH12]
D21: R183.2  [also labelled PH13]
D22: R88.2  [also labelled PH14]
D23: R89.2  [also labelled PH15]
D24: R90.1  [also labelled PI0]
D25: R92.1  [also labelled PI1]
D26: R91.1  [also labelled PI2]
D27: R195.1  [also labelled PI3]
D28: R187.1  [also labelled PI6]
D29: R188.1  [also labelled PI7]
D30: R200.1  [also labelled PI9]
D31: R201.1  [also labelled PI10]
DCMI_D0: U6.F14(PC6) ; port PMOD#11-INT  [also labelled PC6]
DCMI_D1: U6.F13(PC7) ; port PMOD#17-DF-D3  [also labelled PC7]
DCMI_D2: U6.A9(PG10)  [also labelled PG10]
DCMI_D3: U6.E14(PC9) ; port SDIO1_D1  [also labelled PC9]
DCMI_D4: U6.B13(PC11) ; port SDIO1_D3  [also labelled PC11]
DCMI_D5: U6.B12(PD3) ; port PMOD#18-DF-CKOUT  [also labelled PD3]
DCMI_D6: U6.D5(PB8) ; port PMOD#20-DF-CK7  [also labelled PB8]
DCMI_D7: U6.D4(PB9) ; port PMOD#19-DF-D7  [also labelled PB9]
OSC_25M: R72.1 R73.2 X2.3(OUT)
PA0: U6.N5(PA0) ; port PMOD#1-CTS
PA0_C: U6.T1(PA0_C) ; port ARD_A2
PA1: U6.N4(PA1) ; port RMII_REF_CLK
PA1_C: U6.T2(PA1_C) ; port ARD_A3
PA2: U6.N3(PA2) ; port ETH_MDIO
PA3: U6.U2(PA3)  [also labelled ULPI_D0]
PA4: SB3.2 U6.U3(PA4) ; port DCMI_HSYNC, port ARD_A0
PA5: U6.T3(PA5) ; port ULPI_CK
PA6: SB4.2 U6.R3(PA6) ; port DCMI_PIXCK
PA7: U6.R5(PA7) ; port RMII_CRS_DV
PA8: U6.E15(PA8) ; port CEC_CLK
PA9: U6.D15(PA9) ; port USART1_TX
PA10: U6.D14(PA10) ; port USART1_RX
PA11: U6.E17(PA11) ; port PMOD#1-NSS
PA12: U6.E16(PA12) ; port PMOD#4-SCK
PA13: U6.C15(PA13) ; port TMS/SWDIO
PA14: U6.B14(PA14) ; port TCK/SWCLK
PA15: U6.A14(PA15) ; port TDI
PB0: U6.U5(PB0)  [also labelled ULPI_D1]
PB1: U6.T5(PB1)  [also labelled ULPI_D2]
PB2: R56.2 ; port QSPI_CLK
PB3: U6.C6(PB3) ; port TDO/SWO
PB4: U6.B7(PB4) ; port TRST
PB5: U6.A5(PB5)  [also labelled ULPI_D7]
PB6: U6.B5(PB6) ; port CEC
PB7: U6.C5(PB7) ; port DCMI_VSYNC
PB10: U6.P11(PB10)  [also labelled ULPI_D3]
PB11: U6.P12(PB11)  [also labelled ULPI_D4]
PB12: U6.T14(PB12)  [also labelled ULPI_D5]
PB13: U6.U14(PB13)  [also labelled ULPI_D6]
PB14: U6.U15(PB14) ; port PMOD#9-MISOs
PB15: U6.T15(PB15) ; port PMOD#8-MOSIs
PC0: U6.L2(PC0) ; port ULPI_STP
PC1: SB8.2 U6.M2(PC1) ; port SAI4_D1
PC2: U6.M3(PC2) ; port PMOD#3-MISOp
PC2_C: U6.R1(PC2_C) ; port ARD_A4
PC3: U6.M4(PC3) ; port PMOD#2-MOSIp
PC3_C: U6.R2(PC3_C) ; port ARD_A5
PC4: U6.T4(PC4) ; port RMII_RXD0
PC5: U6.U4(PC5) ; port RMII_RXD1
PC8: U6.E13(PC8) ; port SDIO1_D0
PC10: U6.A13(PC10) ; port SDIO1_D2
PC12: U6.C12(PC12) ; port SDIO1_CLK
PC13: U6.E3(PC13) ; port WAKEUP
PC14: R77.2 U6.C2(PC14-OSC32_IN)
PC15: R78.2 U6.C1(PC15-OSC32_OUT)
PD2: U6.D12(PD2) ; port SDIO1_CMD
PD4: U6.A12(PD4) ; port PMOD#4-RTS
PD5: U6.A11(PD5) ; port PMOD#2-TX
PD6: U6.B11(PD6) ; port PMOD#3-RX
PD7: U6.C11(PD7) ; port SPDIF_RX0
PD11: R157.2 ; port QSPI_BK1_IO0
PD12: U6.R16(PD12) ; port I2C4_SCL
PD13: U6.R17(PD13) ; port I2C4_SDA
PE0: U6.C4(PE0) ; port FMC_NBL0
PE1: U6.B4(PE1) ; port FMC_NBL1
PE2: R87.2 SB17.1 U6.C3(PE2)
PE3: U6.D3(PE3) ; port SAI1_SDB
PE4: U6.D2(PE4) ; port SAI1_FSA
PE5: U6.D1(PE5) ; port SAI1_SCKA
PE6: U6.E5(PE6) ; port SAI1_SDA
PF6: R69.1 ; port QSPI_BK1_IO3
PF7: U6.K3(PF7) ; port QSPI_BK1_IO2
PF8: SB39.1 U6.K4(PF8) ; port PMOD#14-PWM
PF9: R140.1 ; port QSPI_BK1_IO1
PF10: U6.L3(PF10) ; port ARD_A1
PF11: R144.1 ; port SDNRAS
PG3: R82.1 ; port DSI_RESET
PG6: R176.2 ; port QSPI_BK1_NCS  [project net NCS2]
PG7: U6.F16(PG7) ; port SAI1_MCLKA
PG8: R179.1 ; port SDCLK
PG9: R181.2 ; port QSPI_BK2_IO2  [project net BK2_IO2]
PG11: R93.1 ; port RMII_TX_EN
PG12: R193.1 ; port RMII_TXD1
PG13: R194.1 ; port RMII_TXD0
PG14: R178.2 ; port QSPI_BK2_IO3  [project net BK2_IO3]
PG15: R189.1 ; port SDNCAS
PH0: R73.1 U6.J2(PH0-OSCIN)
PH1: U6.J1(PH1-OSCOUT)
PH2: R141.2 ; port QSPI_BK2_IO0  [project net BK2_IO0]
PH3: R139.2 ; port QSPI_BK2_IO1  [project net BK2_IO1]
PH4: U6.P3(PH4) ; port ULPI_NXT
PH5: R142.2 ; port SDNWE
PH6: R48.2 ; port SDNE1
PH7: U6.U13(PH7) ; port SDCKE1
PI4: U6.A4(PI4) ; port FMC_NBL2
PI5: U6.A3(PI5) ; port FMC_NBL3
PI8: U6.E4(PI8) ; port uSD_Detect
PI11: U6.F4(PI11) ; port ULPI_DIR
PI12: U6.H1(PI12) ; port LED1
PI13: U6.H2(PI13) ; port LED2
PI14: U6.H3(PI14) ; port LED3
PI15: U6.P5(PI15) ; port LED4
PJ0: U6.N6(PJ0) ; port ARD_D7
PJ1: U6.P6(PJ1) ; port OTG_HS_OverCurrent
PJ2: U6.T6(PJ2) ; port DSI_TE
PJ3: U6.U6(PJ3) ; port ARD_D2
PJ4: U6.U7(PJ4) ; port ARD_D4
PJ5: U6.R12(PJ5) ; port ARD_D8
PJ6: U6.N15(PJ6) ; port ARD_D9
PJ7: U6.N14(PJ7) ; port ARD_D6
PJ8: U6.N13(PJ8) ; port ARD_D1
PJ9: U6.M14(PJ9) ; port ARD_D0
PJ10: U6.L14(PJ10) ; port ARD_D11
PJ11: U6.K14(PJ11) ; port ARD_D12
PJ12: U6.D11(PJ12) ; port LCD_BL_CTRL
PJ13: U6.E10(PJ13) ; port PMOD#12-RST
PJ14: U6.D10(PJ14) ; port DCMI_PWR_EN
PJ15: U6.B10(PJ15) ; port Audio_INT
PK0: U6.J14(PK0) ; port ARD_D13
PK1: U6.J15(PK1) ; port ARD_D10
PK2: U6.H17(PK2) ; port JOY_SEL
PK3: U6.C8(PK3) ; port JOY_DOWN
PK4: U6.B8(PK4) ; port JOY_LEFT
PK5: U6.A8(PK5) ; port JOY_RIGHT
PK6: U6.C7(PK6) ; port JOY_UP
PK7: U6.D7(PK7) ; port TOUCH_INT
RESET#: C120.2 R202.1 U6.K1(NRST)
NetB1_2: B1.2(B0) B1.3(B1) D13.1(IO1) R202.2 ; port RESET#
NetC31_1: C31.1 R77.1 X3.2
NetC34_1: C34.1 R78.1 X3.1
NetCN6_4: SB39.2 ; port ARD_D3
NetCN6_6: SB4.1 ; port ARD_D5
NetCN7_12: SB17.2 ; port ETH_nINT
NetCN15_3: U6.L16(DSI_CK_P) ; port DSI_CK_P
NetCN15_5: U6.L17(DSI_CK_N) ; port DSI_CK_N
NetCN15_9: U6.M16(DSI_D0_P) ; port DSI_D0_P
NetCN15_11: U6.M17(DSI_D0_N) ; port DSI_D0_N
NetCN15_15: U6.K16(DSI_D1_P) ; port DSI_D1_P
NetCN15_17: U6.K17(DSI_D1_N) ; port DSI_D1_N
NetP2_13: SB3.1 ; port PMOD#13-ADC
NetR48_1: R48.1 U6.T11(PH6)
NetR49_2: R49.2 U6.T10(PE13)
NetR50_2: R50.2 U6.U10(PE14)
NetR51_2: R51.2 U6.T9(PE8)
NetR52_2: R52.2 U6.U9(PE7)
NetR53_2: R53.2 U6.P8(PF14)
NetR54_2: R54.2 U6.U8(PG1)
NetR55_2: R55.2 U6.T8(PG0)
NetR56_1: R56.1 U6.R6(PB2)
NetR59_2: R59.2 U6.U16(PD8)
NetR60_2: R60.2 U6.T16(PD10)
NetR62_2: R62.2 U6.T17(PD9)
NetR65_2: R65.2 U6.P15(PD15)
NetR67_2: R67.2 U6.P16(PD14)
NetR69_2: R69.2 U6.K2(PF6)
NetR70_2: R70.2 X2.1(EN)
NetR72_2: R72.2 ; port OSC_25M
NetR82_2: R82.2 U6.H15(PG3)
NetR87_1: R87.1 ; port SAI4_CK1
NetR88_1: R88.1 U6.B17(PH14)
NetR89_1: R89.1 U6.B16(PH15)
NetR90_2: R90.2 U6.A16(PI0)
NetR91_2: R91.2 U6.B15(PI2)
NetR92_2: R92.2 U6.A15(PI1)
NetR93_2: R93.2 U6.B9(PG11)
NetR139_1: R139.1 U6.P2(PH3)
NetR140_2: R140.2 U6.L4(PF9)
NetR141_1: R141.1 U6.N2(PH2)
NetR142_1: R142.1 U6.P4(PH5)
NetR143_2: R143.2 U6.R7(PF12)
NetR144_2: R144.2 U6.T7(PF11)
NetR145_2: R145.2 U6.P7(PF13)
NetR146_2: R146.2 U6.N9(PE10)
NetR147_2: R147.2 U6.R9(PF15)
NetR148_2: R148.2 U6.P9(PE9)
NetR149_2: R149.2 U6.R10(PE12)
NetR150_2: R150.2 U6.R11(PE15)
NetR151_2: R151.2 U6.P10(PE11)
NetR152_1: R152.1 U6.T13(PH8)
NetR154_1: R154.1 U6.R14(PH12)
NetR157_1: R157.1 U6.R15(PD11)
NetR159_1: R159.1 U6.R13(PH9)
NetR162_1: R162.1 U6.P14(PH11)
NetR165_1: R165.1 U6.P13(PH10)
NetR168_2: R168.2 U6.H14(PG4)
NetR169_2: R169.2 U6.G14(PG5)
NetR172_2: R172.2 U6.H16(PG2)
NetR176_1: R176.1 U6.G15(PG6)
NetR178_1: R178.1 U6.D8(PG14)
NetR179_2: R179.2 U6.F15(PG8)
NetR180_2: R180.2 U6.E12(PD1)
NetR181_1: R181.1 U6.A10(PG9)
NetR182_2: R182.2 U6.D13(PD0)
NetR183_1: R183.1 U6.D16(PH13)
NetR184_2: R184.2 U6.J4(PF5)
NetR185_2: R185.2 U6.G1(PF2)
NetR186_2: R186.2 U6.H4(PF3)
NetR187_2: R187.2 U6.A2(PI6)
NetR188_2: R188.2 U6.B3(PI7)
NetR189_2: R189.2 U6.D6(PG15)
NetR190_1: R190.1 R191.2 U6.E7(PDR_ON)
NetR193_2: R193.2 U6.C9(PG12)
NetR194_2: R194.2 U6.D9(PG13)
NetR195_2: R195.2 U6.C14(PI3)
NetR197_2: R197.2 U6.J5(PF4)
NetR198_2: R198.2 U6.G3(PF1)
NetR199_2: R199.2 U6.G4(PF0)
NetR200_2: R200.2 U6.E2(PI9)
NetR201_2: R201.2 U6.F3(PI10)
NetSB8_1: SB8.1 ; port ETH_MDC

### Buses and harness runs
bus A[0..15] = port A[0..15]
bus D[0..31] = port D[0..31]
bus DCMI_D[0..7] = port DCMI_D[0..7]
bus ULPI_D[0..7] = port ULPI_D[0..7]

### Notes on the sheet
- (near R73) Capacitor close to MCU
- Title:
- Project:
- Size:
- Revision:
- Variant:
- A3
- -
- Date:
- Reference:
- Sheet:
- of
- (in symbol STM32H747XIH6, part A) 1 of 3
- (in symbol STM32H747XIH6, part B) 2 of 3
- (in symbol STM32H747XIH6, part C) 3 of 3

### Library data of the parts
B1 = SW PUSHBUTTON: SE PUSHBUTTON
C22 C31 C34 = CAP: Capacitor
  C22: Published: 8-Jun-2000; Revision: July-2002: Re-released for DXP Platform.; Publisher: Altium Limited; Value: 100nF
C120 = CAP: Capacitor; Value: 100pF; Published: 8-Jun-2000; Revision: July-2002: Re-released for DXP Platform.; Publisher: Altium Limited
D13 = ESDALC6V1-1U2: Dual Transil array for ESD protection; Manuf_1: STM; Ref St: .; ECCN_US/EU: EAR99/NEC; Fitted: YES; Provided: ST; Manuf_Part_1: ESDA7P60-1U1M; Distrib: ST; Ordered by: STM; Order: ESDA7P60-1U1M
HW1 = MCD-02420: Black round cap for TSS6x series; Part_Type: Mechanical; Part_Preference: Recommended; Manufacturer: KNITTER-SWITCH; Manufacturer_Part_Number: KTSC-62K; Manufacturer_HQ_COO: Unknown; Partial_Alternate_Internal_Part_Number: MCD-02526; Value: SW-CAP-KTSC-62K; Component_Country_Of_Origin: China; Alternate_EMS: M; ShowFields: YES; ID: 4526; Order_code_Digikey: N/A; Order_code_Farnell: N/A; Order_code_RS: N/A; Status: Released; ComponentLink1URL: http://tunmcdsvn.tun.st.com/Component_Documentation_Library/Trunk/Mechanical/KNITTER_SWITCH_KTSC-62_Series; Internal_Part_Number: MCD-02420
R48-R56 R59 R60 R62 R65 R67 R69 R72 R73 R77 R78 R82 R87-R93 R139-R152 R154 R157 R159 R162 R165 R168 R169 R172 R176 R178-R189 R191 R193-R195 R197-R201 = Res1: Resistor; Value: 1K; Published: 8-Jun-2000; Revision: July-2002: Re-released for DXP Platform.; Publisher: Altium Limited
R70 = Res_10K_1%_0402: Resistor,10K,0402,1%,YAGEO; Value: 10K; Manuf_1: YAGEO; ECCN_US/EU: n/a
R190 R192 = res1: Resistor; Value: 1K; Ordered by: Subcon; ECCN_US/EU: NA; Fitted: NO; Published: 8-Jun-2000; Revision: July-2002: Re-released for DXP Platform.; Publisher: Altium Limited
R196 R202 = res1: Resistor; Value: 1K; Published: 8-Jun-2000; Revision: July-2002: Re-released for DXP Platform.; Publisher: Altium Limited
SB3 SB4 SB39 = SB_ON: Fitted: YES; Ordered by: Subcon; Revision: July-2002: Re-released for DXP Platform.; ECCN_US/EU: n/a
SB8 SB17 = SB_OFF: Fitted: NO; Ordered by: Subcon; Revision: July-2002: Re-released for DXP Platform.; ECCN_US/EU: n/a
U6 = STM32H7_TFBGA265: Fitted: YES; Ordered by: STM; ECCN_US/EU: 3A991A2/NEC; Manuf_1: STM; Manuf_Part_1: STM32H747XIH6U
X2 = OSC_25M_NZ2520SB: Oscillator 25.00Mhz, -+50PPM, 3.3V, Temp -55 to +125癈; Manuf_Part_1: NZ2520SB 25MHz END4869B; Manuf_1: NDK; Manuf_Part_2: KC2520B25.0000C10E00; Manuf_2: AVX Corp/Kyocera Corp; Ordered by: STM; ECCN_US/EU: EAR99/NEC; Ref St: 9157031; Fitted: YES
X3 = CRYSTAL_32K: Crystal; Manuf_1: NDK; ECCN_US/EU: EAR99/NEC; Ordered by: STM; Fitted: YES; Manuf_Part_1: NX3215SA-32.768KHZ-EXS00A-MU00525

## Sheet Memory.SchDoc: SDRAM
size A4; Project: STM32H7-DK; Date: Not used; ApprovedBy: Not used; CheckedBy: Not used; Author: Not used; CompanyName: STMicroelectronics; DrawnBy: Not used; Engineer: Not used; Organization: Not used; Address1: Not used; Address2: Not used; Address3: Not used; Address4: Not used; DocumentNumber: Not used; Revision: Not used; SheetNumber: 5; SheetTotal: 16; CurrentTime: Not used; CurrentDate: Not used; Time: Not used; DocumentFullPathAndName: Not used; DocumentName: Not used; ModifiedDate: Not used; ImagePath: Not used; ProjectName: Not used; Application_BuildNumber: Not used
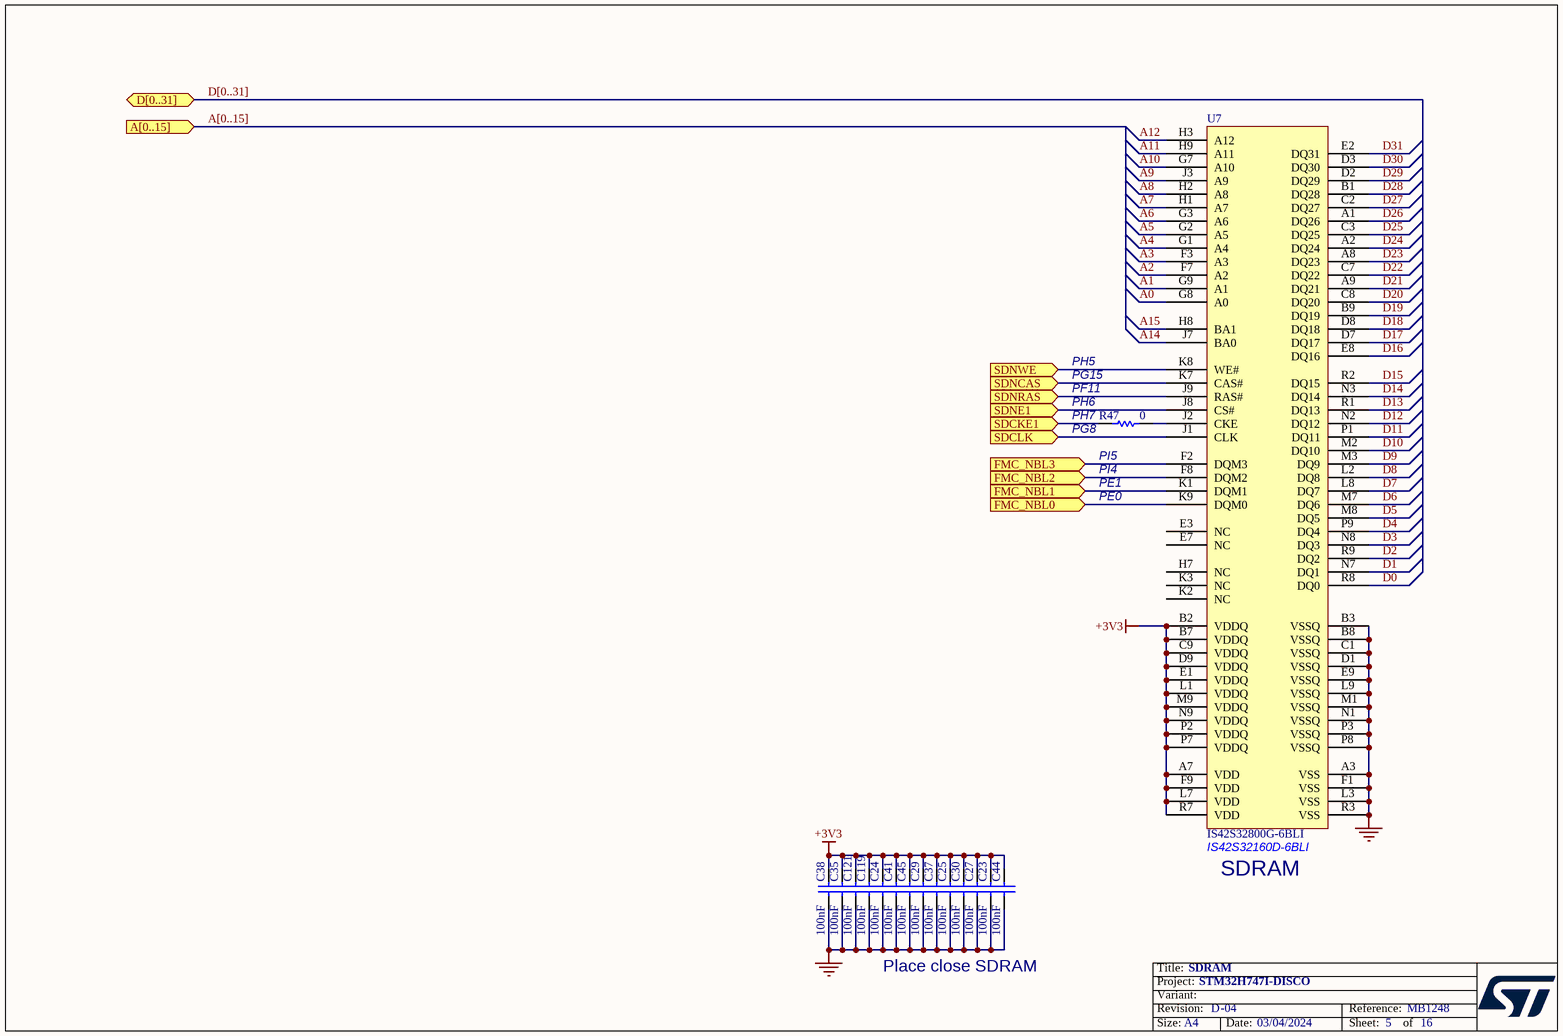
[diagram p3: Memory.SchDoc]

### Parts
C23  100nF  [0603C]
C24  100nF  [0603C]
C25  100nF  [0603C]
C27  100nF  [0603C]
C29  100nF  [0603C]
C30  100nF  [0603C]
C35  100nF  [0603C]
C37  100nF  [0603C]
C38  100nF  [0603C]
C41  100nF  [0603C]
C44  100nF  [0603C]
C45  100nF  [0603C]
C119  100nF  [0603C]
C121  100nF  [0603C]
R47  0  [0603R]
U7  IS42S32800G-6BLI  [FBGA90_0R8_8X13]

### Ports
A[0..15] (in), D[0..31] (bidir), FMC_NBL0 (in), FMC_NBL1 (in), FMC_NBL2 (in), FMC_NBL3 (in), SDCKE1 (in), SDCLK (in), SDNCAS (in), SDNE1 (in), SDNRAS (in), SDNWE (in)

### Nets
+3V3: C23.1 C24.1 C25.1 C27.1 C29.1 C30.1 C35.1 C37.1 C38.1 C41.1 C44.1 C45.1 C119.1 C121.1 U7.A7(VDD) U7.B2(VDDQ) U7.B7(VDDQ) U7.C9(VDDQ) U7.D9(VDDQ) U7.E1(VDDQ) U7.F9(VDD) U7.L1(VDDQ) U7.L7(VDD) U7.M9(VDDQ) U7.N9(VDDQ) U7.P2(VDDQ) U7.P7(VDDQ) U7.R7(VDD)
GND: C23.2 C24.2 C25.2 C27.2 C29.2 C30.2 C35.2 C37.2 C38.2 C41.2 C44.2 C45.2 C119.2 C121.2 U7.A3(VSS) U7.B3(VSSQ) U7.B8(VSSQ) U7.C1(VSSQ) U7.D1(VSSQ) U7.E9(VSSQ) U7.F1(VSS) U7.L3(VSS) U7.L9(VSSQ) U7.M1(VSSQ) U7.N1(VSSQ) U7.P3(VSSQ) U7.P8(VSSQ) U7.R3(VSS)
A0: U7.G8(A0)
A1: U7.G9(A1)
A2: U7.F7(A2)
A3: U7.F3(A3)
A4: U7.G1(A4)
A5: U7.G2(A5)
A6: U7.G3(A6)
A7: U7.H1(A7)
A8: U7.H2(A8)
A9: U7.J3(A9)
A10: U7.G7(A10)
A11: U7.H9(A11)
A12: U7.H3(A12)
A14: U7.J7(BA0)
A15: U7.H8(BA1)
D0: U7.R8(DQ0)
D1: U7.N7(DQ1)
D2: U7.R9(DQ2)
D3: U7.N8(DQ3)
D4: U7.P9(DQ4)
D5: U7.M8(DQ5)
D6: U7.M7(DQ6)
D7: U7.L8(DQ7)
D8: U7.L2(DQ8)
D9: U7.M3(DQ9)
D10: U7.M2(DQ10)
D11: U7.P1(DQ11)
D12: U7.N2(DQ12)
D13: U7.R1(DQ13)
D14: U7.N3(DQ14)
D15: U7.R2(DQ15)
D16: U7.E8(DQ16)
D17: U7.D7(DQ17)
D18: U7.D8(DQ18)
D19: U7.B9(DQ19)
D20: U7.C8(DQ20)
D21: U7.A9(DQ21)
D22: U7.C7(DQ22)
D23: U7.A8(DQ23)
D24: U7.A2(DQ24)
D25: U7.C3(DQ25)
D26: U7.A1(DQ26)
D27: U7.C2(DQ27)
D28: U7.B1(DQ28)
D29: U7.D2(DQ29)
D30: U7.D3(DQ30)
D31: U7.E2(DQ31)
PE0: U7.K9(DQM0) ; port FMC_NBL0
PE1: U7.K1(DQM1) ; port FMC_NBL1
PF11: U7.J9(RAS#) ; port SDNRAS
PG8: U7.J1(CLK) ; port SDCLK
PG15: U7.K7(CAS#) ; port SDNCAS
PH5: U7.K8(WE#) ; port SDNWE
PH6: U7.J8(CS#) ; port SDNE1
PH7: R47.2 ; port SDCKE1
PI4: U7.F8(DQM2) ; port FMC_NBL2
PI5: U7.F2(DQM3) ; port FMC_NBL3
NetR47_1: R47.1 U7.J2(CKE)

Not connected (* = marked no-connect by the designer): U7 E3(NC) E7(NC) H7(NC) K2(NC) K3(NC)

### Buses and harness runs
bus A[0..15] = port A[0..15]
bus D[0..31] = port D[0..31]

### Notes on the sheet
- PH5
- (near R47) PG15
- (near R47) PF11
- (near R47) PH6
- (near R47) PH7
- (near R47) PG8
- PE1
- PE0
- (near R47) PI5
- (near R47) PI4
- (near U7) IS42S32160D-6BLI
- (near U7) SDRAM
- Place close SDRAM
- Title:
- Project:
- Size:
- Revision:
- Variant:
- A4
- -
- Date:
- Reference:
- Sheet:
- of

### Library data of the parts
C23-C25 C27 C29 C30 C35 C37 C38 C41 C44 C45 C119 C121 = Cap: Capacitor; Value: 10nF; Published: 8-Jun-2000; Revision: July-2002: Re-released for DXP Platform.; Publisher: Altium Limited
R47 = Res1: Resistor; Value: 1K; Published: 8-Jun-2000; Revision: July-2002: Re-released for DXP Platform.; Publisher: Altium Limited
U7 = IS42S32160D-6BLI: Manuf_1: ISSI; Fitted: YES; Ordered by: Subcon; ECCN_US/EU: EAR99/NEC; Manuf_Part_1: IS42S32800G-6BLI

## Sheet QSPI.SchDoc: QSPI
size A4; Project: STM32H7-DK; Date: Not used; ApprovedBy: Not used; CheckedBy: Not used; Author: Not used; CompanyName: STMicroelectronics; DrawnBy: Not used; Engineer: Not used; Organization: Not used; Address1: Not used; Address2: Not used; Address3: Not used; Address4: Not used; DocumentNumber: Not used; Revision: Not used; SheetNumber: 9; SheetTotal: 16; CurrentTime: Not used; CurrentDate: Not used; Time: Not used; DocumentFullPathAndName: Not used; DocumentName: Not used; ModifiedDate: Not used; ImagePath: Not used; ProjectName: Not used; Application_BuildNumber: Not used
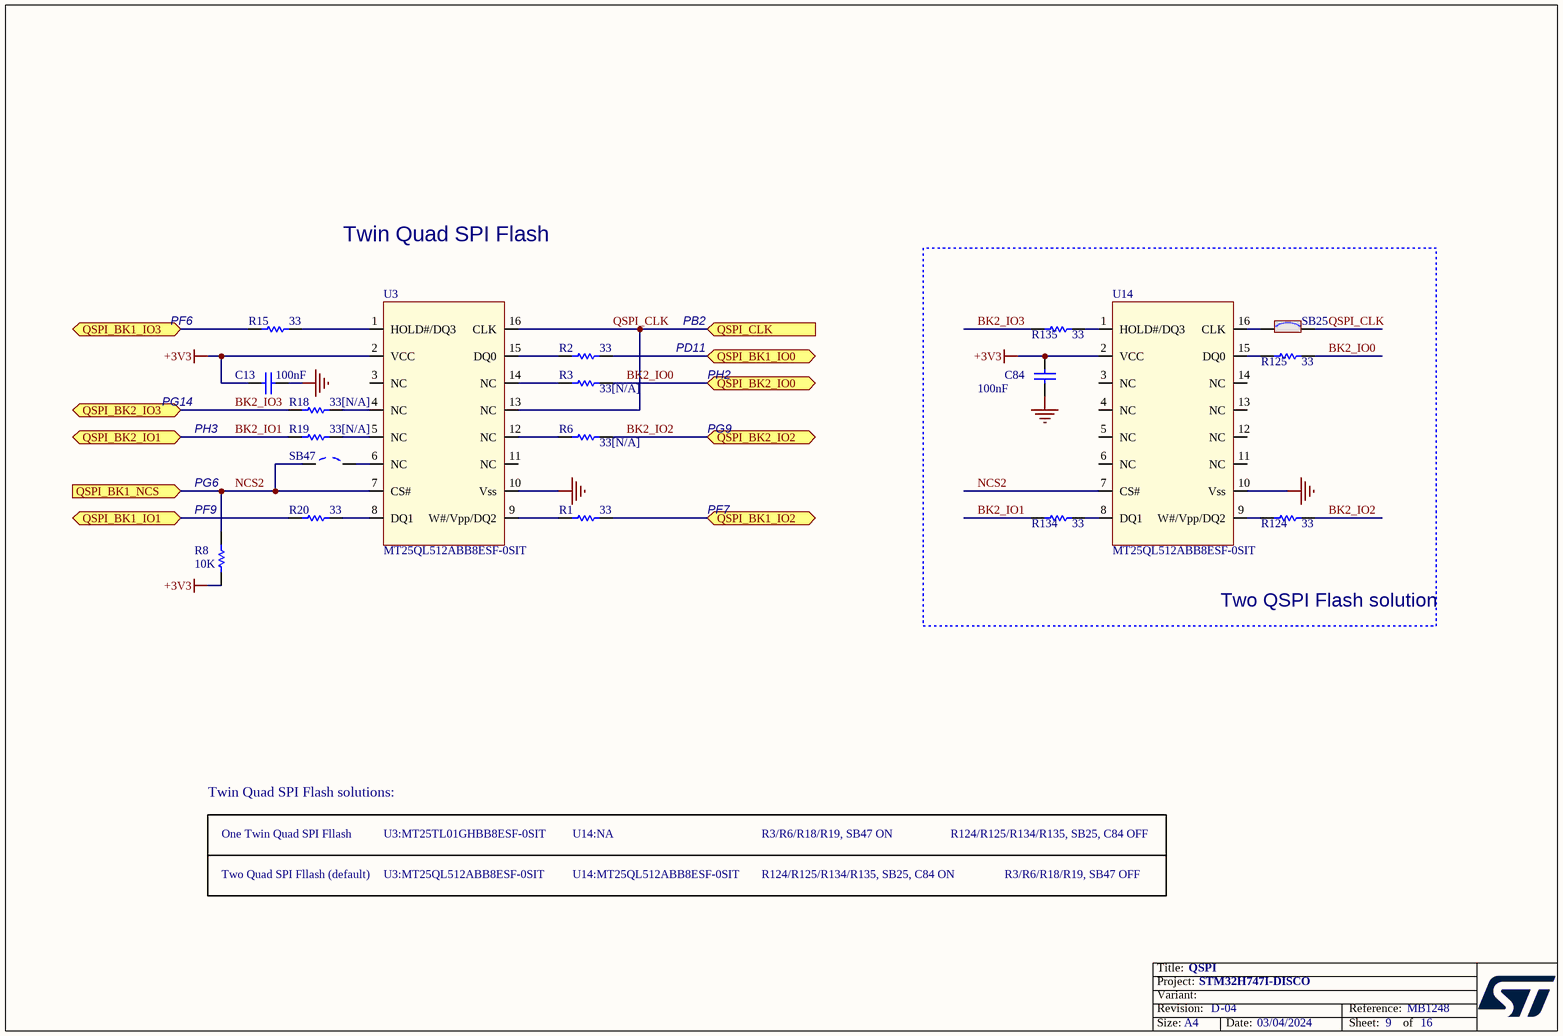
[diagram p4: QSPI.SchDoc]

### Parts
C13  100nF  [0603C]
C84  100nF  [0402C]
R1  33  [0603R]
R2  33  [0603R]
R3  33[N/A]  [0603R]
R6  33[N/A]  [0603R]
R8  10K  [0603R]
R15  33  [0603R]
R18  33[N/A]  [0603R]
R19  33[N/A]  [0603R]
R20  33  [0603R]
R124  33  [0603R]
R125  33  [0603R]
R134  33  [0603R]
R135  33  [0603R]
SB25  Solder Bridge ON  [SB_0603]  (value not drawn)
SB47  Solder Bridge OFF  [SB_0603]  (value not drawn)
U3  MT25QL512ABB8ESF-0SIT  [SOIC16W_1R27_10R3X10R33]
U14  MT25QL512ABB8ESF-0SIT  [SOIC16W_1R27_10R3X10R33]

### Blocks framed on the sheet
Two QSPI Flash solution: C84 R124 R125 R134 R135 SB25 U14

### Ports
QSPI_BK1_IO0 (bidir), QSPI_BK1_IO1 (bidir), QSPI_BK1_IO2 (bidir), QSPI_BK1_IO3 (bidir), QSPI_BK1_NCS (in), QSPI_BK2_IO0 (bidir), QSPI_BK2_IO1 (bidir), QSPI_BK2_IO2 (bidir), QSPI_BK2_IO3 (bidir), QSPI_CLK (in)

### Nets
+3V3: C13.1 C84.1 R8.2 U3.2(VCC) U14.2(VCC)
GND: C13.2 C84.2 U3.10(Vss) U14.10(Vss)
BK2_IO0: R3.1 R125.1 ; port QSPI_BK2_IO0
BK2_IO1: R19.2 R134.2 ; port QSPI_BK2_IO1
BK2_IO2: R6.1 R124.1 ; port QSPI_BK2_IO2
BK2_IO3: R18.2 R135.2 ; port QSPI_BK2_IO3
NCS2: R8.1 SB47.1 U3.7(CS#) U14.7(CS#) ; port QSPI_BK1_NCS
PD11: R2.1 ; port QSPI_BK1_IO0
PF6: R15.2 ; port QSPI_BK1_IO3
PF7: R1.1 ; port QSPI_BK1_IO2
PF9: R20.2 ; port QSPI_BK1_IO1
QSPI_CLK: SB25.2 U3.13(NC) U3.16(CLK) ; port QSPI_CLK  [project net PB2]
NetR1_2: R1.2 U3.9(W#/Vpp/DQ2)
NetR2_2: R2.2 U3.15(DQ0)
NetR3_2: R3.2 U3.14(NC)
NetR6_2: R6.2 U3.12(NC)
NetR15_1: R15.1 U3.1(HOLD#/DQ3)
NetR18_1: R18.1 U3.4(NC)
NetR19_1: R19.1 U3.5(NC)
NetR20_1: R20.1 U3.8(DQ1)
NetR124_2: R124.2 U14.9(W#/Vpp/DQ2)
NetR125_2: R125.2 U14.15(DQ0)
NetR134_1: R134.1 U14.8(DQ1)
NetR135_1: R135.1 U14.1(HOLD#/DQ3)
NetSB25_1: SB25.1 U14.16(CLK)
NetSB47_2: SB47.2 U3.6(NC)

Not connected (* = marked no-connect by the designer): U3 3(NC) 11(NC); U14 3(NC) 4(NC) 5(NC) 6(NC) 11(NC) 12(NC) 13(NC) 14(NC)

### Notes on the sheet
- Twin Quad SPI Flash
- PF6
- PD11
- PB2
- PH2
- (near C13) PG14
- PH3
- PG9
- (near R8) PF9
- PG6
- PF7
- Twin Quad SPI Flash solutions:
- One Twin Quad SPI Fllash
- U3:MT25TL01GHBB8ESF-0SIT
- U14:NA
- R3/R6/R18/R19, SB47 ON
- R124/R125/R134/R135, SB25, C84 OFF
- Two Quad SPI Fllash (default)
- U3:MT25QL512ABB8ESF-0SIT
- U14:MT25QL512ABB8ESF-0SIT
- R124/R125/R134/R135, SB25, C84 ON
- R3/R6/R18/R19, SB47 OFF
- Title:
- Project:
- Size:
- Revision:
- Variant:
- A4
- -
- Date:
- Reference:
- Sheet:
- of

### Library data of the parts
C13 C84 = Cap: Capacitor; Value: 10nF; Ordered by: Subcon; Published: 8-Jun-2000; Revision: July-2002: Re-released for DXP Platform.; Publisher: Altium Limited
R1 R2 R15 R20 R124 R125 R134 R135 = Res1: Resistor; Value: 1K; Published: 8-Jun-2000; Revision: July-2002: Re-released for DXP Platform.; Publisher: Altium Limited
R3 R6 R18 R19 = Res1: Resistor; Value: 1K; Fitted: NO; Published: 8-Jun-2000; Revision: July-2002: Re-released for DXP Platform.; Publisher: Altium Limited
R8 = res1: Resistor; Value: 1K; Ordered by: Subcon; Published: 8-Jun-2000; Revision: July-2002: Re-released for DXP Platform.; Publisher: Altium Limited
SB25 = SB_ON: Fitted: YES; Ordered by: Subcon; Revision: July-2002: Re-released for DXP Platform.; ECCN_US/EU: n/a
SB47 = SB_OFF: Fitted: NO; Ordered by: Subcon; Revision: July-2002: Re-released for DXP Platform.; ECCN_US/EU: n/a
U3 U14 = QSPI_16pins: ECCN_US/EU: 3A991